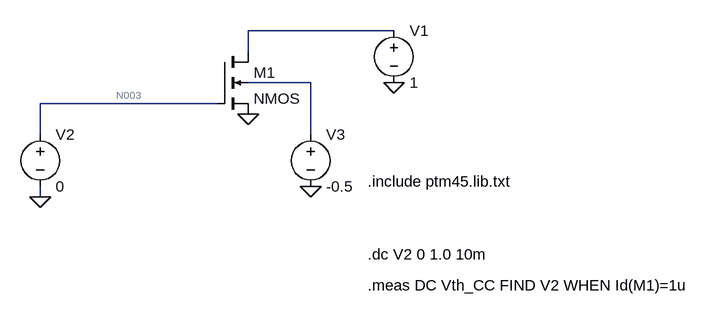
[diagram p0: schematic cmos_char.asc]
cmos_char.asc, the LTspice schematic file:
Version 4
SHEET 1 980 680
WIRE 400 80 176 80
WIRE 176 112 176 80
WIRE 272 160 176 160
WIRE 128 192 -144 192
WIRE -144 240 -144 192
WIRE 272 240 272 160
WIRE -144 336 -144 320
FLAG 400 160 0
FLAG -144 336 0
FLAG 176 208 0
FLAG 272 320 0
SYMBOL nmos4 128 112 R0
SYMATTR InstName M1
SYMATTR Value2 l=100n w=1u
SYMBOL voltage 400 64 R0
SYMATTR InstName V1
SYMATTR Value 1
SYMBOL voltage -144 224 R0
WINDOW 123 0 0 Left 0
WINDOW 39 0 0 Left 0
SYMATTR InstName V2
SYMATTR Value 0
SYMBOL voltage 272 224 R0
WINDOW 123 0 0 Left 0
WINDOW 39 0 0 Left 0
SYMATTR InstName V3
SYMATTR Value -0.5
TEXT 360 312 Left 2 !.include ptm45.lib.txt
TEXT 360 424 Left 2 !.dc V2 0 1.0 10m
TEXT 360 472 Left 2 !.meas DC Vth_CC FIND V2 WHEN Id(M1)=1u

The netlist it stands for:
* cmos_char.asc
M1 N001 N003 0 N002 NMOS l=100n w=1u
V1 N001 0 1
V2 N003 0 0
V3 N002 0 -0.5
.model NMOS NMOS
.model PMOS PMOS
.lib standard.mos
.include ptm45.lib.txt
.dc V2 0 1.0 10m
.meas DC Vth_CC FIND V2 WHEN Id(M1)=1u
.backanno
.end

* Results of the author's LTspice run, read from the files saved beside the schematic
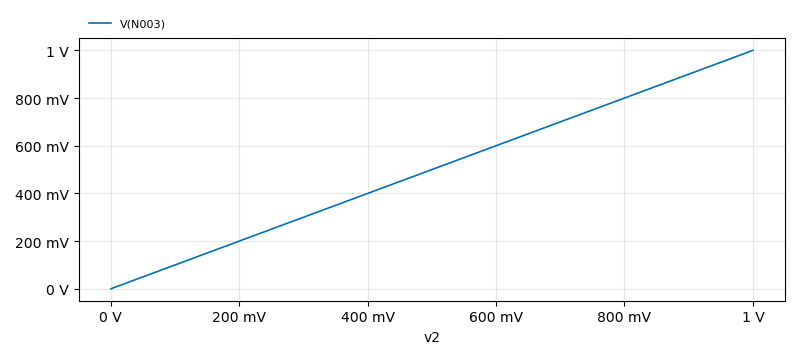
[diagram p1: DC transfer characteristic of cmos_char.asc, plotted from the saved traces]
* DC transfer characteristic, 1 run:
*   V(N003): 0 V at v2=0 V, 1 V at v2=1 V, min 0 V, max 1 V
* From the log:
*   vth_cc: v2=0.442987 at 0.442987